# EAGLE design tracksoar programmer (EAGLE 7.1.0)
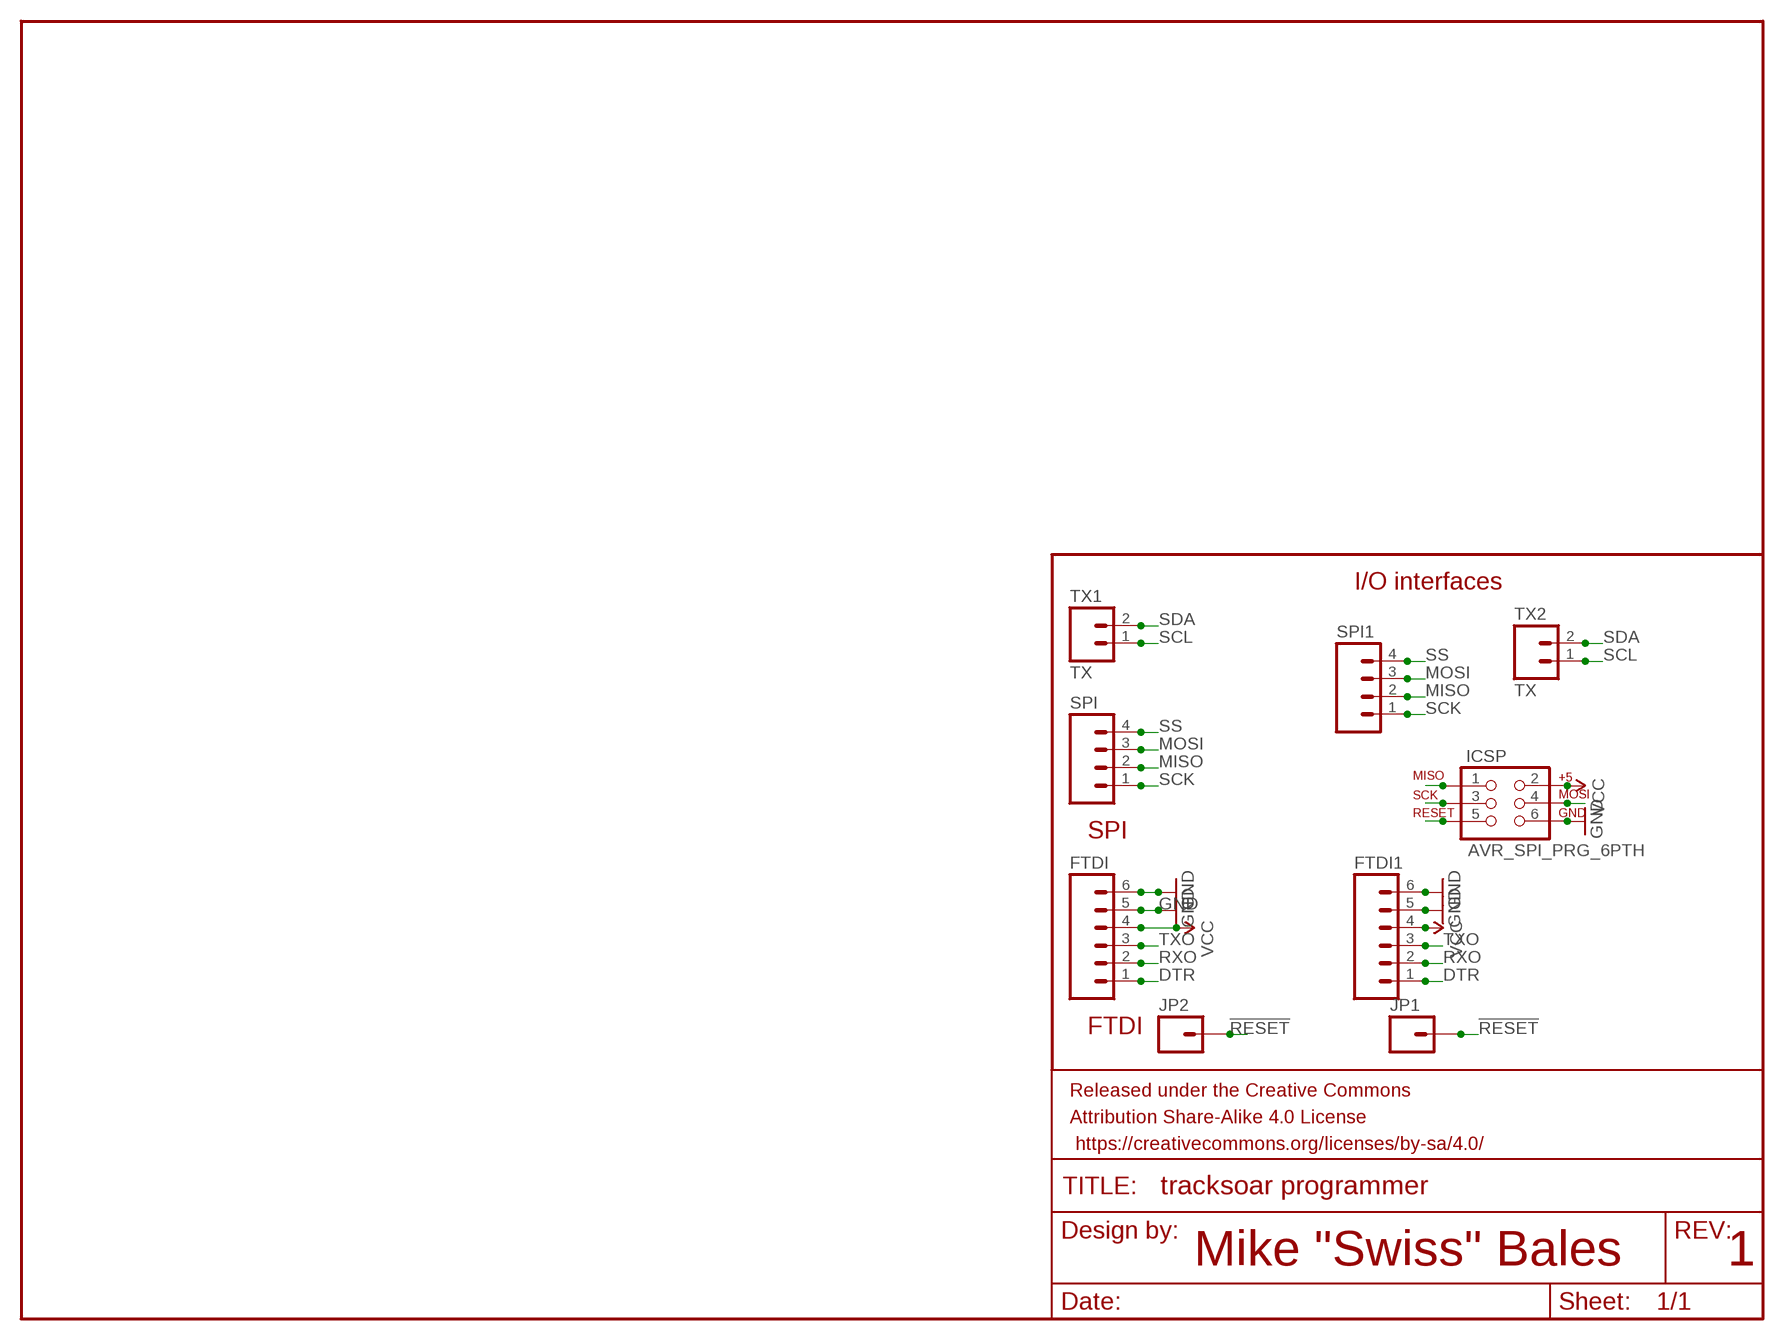
[diagram p0: schematic, sheet 1]

## Parts
FRAME1  FRAME-LETTER  [CREATIVE_COMMONS]
FTDI  M06NO_SILK_FEMALE_PTH  [1X06_NO_SILK]
FTDI1  M06NO_SILK_FEMALE_PTH  [1X06_NO_SILK]
ICSP  AVR_SPI_PRG_6PTH  [2X3]
JP1  M01PTH  [1X01]
JP2  M01PTH  [1X01]
SPI  M04JST-PTH-VERT  [JST-4-PTH-VERT]
SPI1  M04JST-PTH-VERT  [JST-4-PTH-VERT]
TX1  TX  M02JST-PTH-VERT  [JST-2-PTH-VERT]
TX2  TX  M02JST-PTH-VERT  [JST-2-PTH-VERT]

## Nets
!RESET: ICSP.5 JP1.1 JP2.1
DTR: FTDI1.1 FTDI.1
GND: FTDI1.5 FTDI1.6 FTDI.5 FTDI.6 ICSP.6
MISO: ICSP.1 SPI1.2 SPI.2
MOSI: ICSP.4 SPI1.3 SPI.3
RXO: FTDI1.2 FTDI.2
SCK: ICSP.3 SPI1.1 SPI.1
SCL: TX1.1 TX2.1
SDA: TX1.2 TX2.2
SS: SPI1.4 SPI.4
TXO: FTDI1.3 FTDI.3
VCC: FTDI1.4 FTDI.4 ICSP.2

## Notes on the sheet
- I/O interfaces
- SPI
- FTDI
- Mike "Swiss" Bales | 1

## Library data of the parts
FRAME1 = SparkFun-Aesthetics:FRAME-LETTER: Schematic Frame Standard 8.5x11 US Letter frame
FTDI FTDI1 = SparkFun-Connectors:M06: Header 6 Standard 6-pin 0.1" header. Use with straight break away headers (SKU : PRT-00116), right angle break away headers (PRT-00553), swiss pins (PRT-00743), machine pins (PRT-00117), and female headers (PRT-00115). Molex polarized connector foot print use with SKU : PRT-08094 with associated crimp pins and housings. NOTES ON THE VARIANTS LOCK and LOCK_LONGPADS... This footprint was designed to help hold the alignment of a through-hole component (i.e. 6-pin header) while soldering it into place. You may notice that each hole has been shifted either up or down by 0.005 of an inch from it's more standard position (which is a perfectly straight line). This slight alteration caused the pins (the squares in the middle) to touch the edges of the holes. Because they are alternating, it causes a "brace" to hold the component in place. 0.005 has proven to be the perfect amount of "off-center" position when using our standard breakaway headers. Although looks a little odd when you look at the bare footprint, once you have a header in there, the alteration is very hard to notice. Also,if you push a header all the way into place, it is covered up entirely on the bottom side. This idea of altering the position of holes to aid alignment will be further integrated into the Sparkfun Library for other footprints. It can help hold any component with 3 or more connection pins.; PROD_ID: CONN-08437
ICSP = SparkFun-Connectors:AVR_SPI_PRG_6: AVR ISP 6 Pin This is the reduced ISP connector for AVR programming. Common on Arduino. This footprint will take up less PCB space and can be used with a 10-pin to 6-pin adapter such as SKU: BOB-08508 **Special note about "TEST_POINT" package. The stop mask is on the top side, so if you want your programming test points to be on the bottom of your board, make sure to place this package on the bottom side of the board. This also ensure that the orientation to program from the bottom side will be correct.
JP1 JP2 = SparkFun-Connectors:M01: Header 1 Standard 1-pin 0.1" header. Use with straight break away headers (SKU : PRT-00116), right angle break away headers (PRT-00553), swiss pins (PRT-00743), machine pins (PRT-00117), and female headers (PRT-00115).
SPI SPI1 = SparkFun-Connectors:M04: Header 4 Standard 4-pin 0.1" header. Use with straight break away headers (SKU : PRT-00116), right angle break away headers (PRT-00553), swiss pins (PRT-00743), machine pins (PRT-00117), and female headers (PRT-00115). Molex polarized connector foot print use with SKU : PRT-08231 with associated crimp pins and housings. 1MM SMD Version SKU: PRT-10208
TX1 TX2 = SparkFun-Connectors:M02: Standard 2-pin 0.1" header. Use with - straight break away headers ( PRT-00116) - right angle break away headers (PRT-00553) - swiss pins (PRT-00743) - machine pins (PRT-00117) - female headers (PRT-00115) Molex polarized connector foot print use with: PRT-08233 with associated crimp pins and housings. 2.54_SCREWTERM for use with PRT-10571. 3.5mm Screw Terminal footprints for PRT-08084 5mm Screw Terminal footprints for use with PRT-08432

## Board
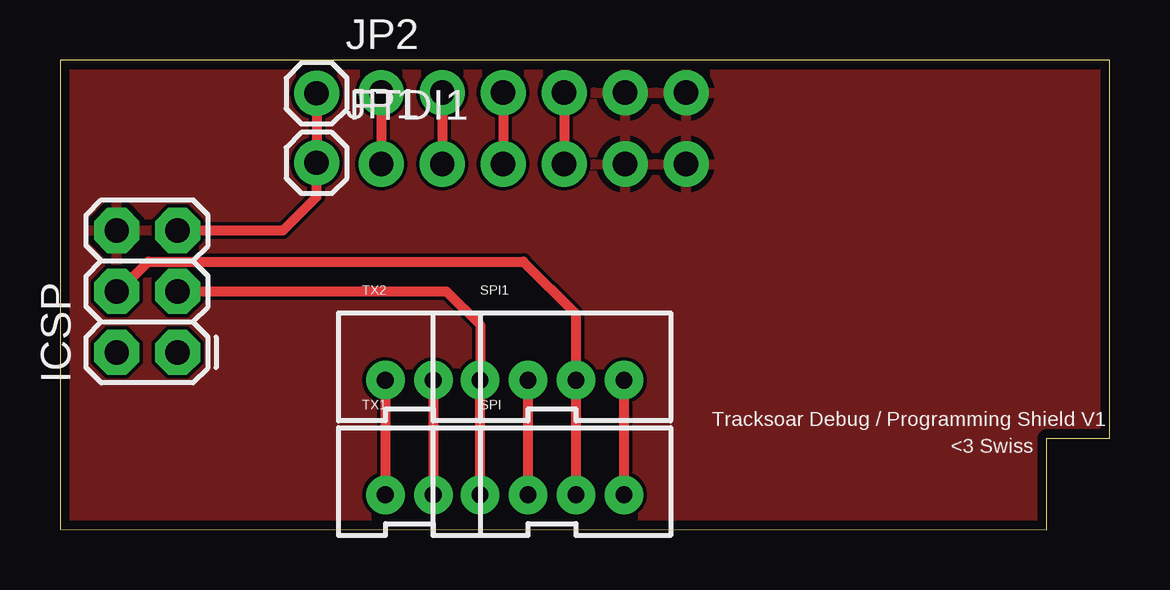
[diagram p1: board, top side]
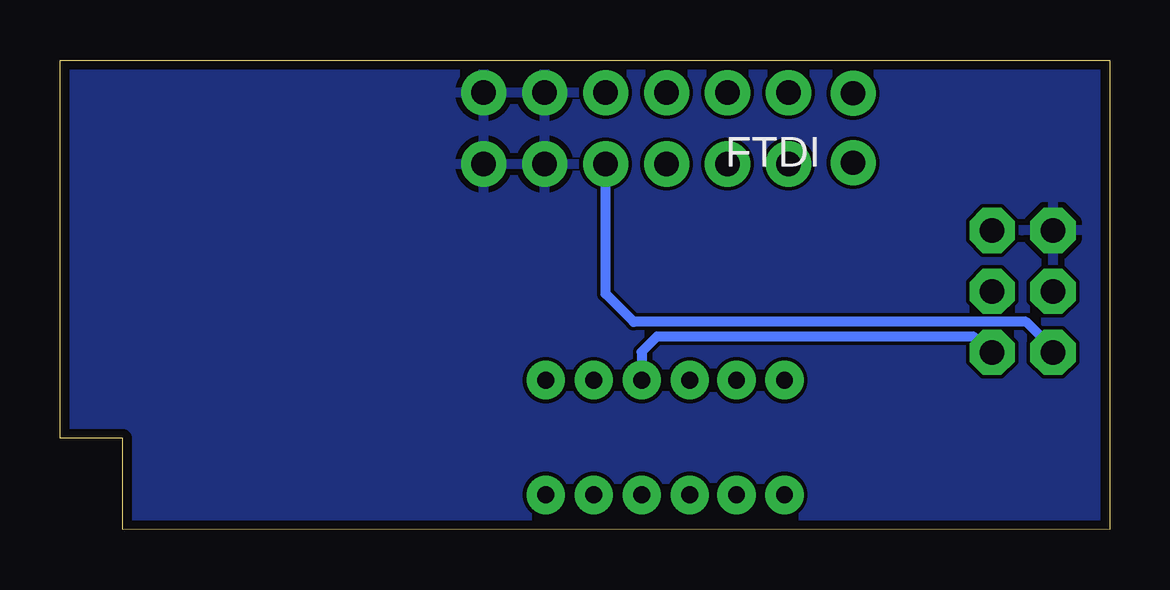
[diagram p2: board, bottom side, seen from below]

Size 43.74 x 19.57 mm. Coordinates in mm from the lower left corner, seen from the top.
Outline: 41.12,0 0,0.03 0,19.57 43.74,19.57 43.74,3.81 41.12,3.81 41.12,0.03
Copper layers (1*16): Top 0.0356mm / dielectric 1.5011mm / Bottom 0.0356mm
Design rules "oshpark-2layer": minimum track width 6mil, minimum drill 13mil, track to track 6mil, track to pad 6mil, pad to pad 6mil, via to via 6mil, smd to smd 6mil, copper to edge 15mil, drill to drill 6mil, minimum pad ring 7mil, minimum via ring 7mil, stop-mask expansion 4mil, vias tented up to drill 0mil, thermal gap 10mil

### Footprints (pad centres in the part's own frame; a part is rotated, then mirrored left to right if it is on the bottom)
1X06_NO_SILK = drill 1.016 pad 1.88: 1 0,0; 2 2.54,0; 3 5.08,0; 4 7.62,0; 5 10.16,0; 6 12.7,0
2X3 = drill 1.016 pad 1.88 octagon: 1 0,0; 2 0,2.54; 3 2.54,0; 4 2.54,2.54; 5 5.08,0; 6 5.08,2.54
1X01 = drill 1.016 pad 1.88: 1 0,0
JST-4-PTH-VERT = drill 0.7 pad 1.6: 1 -3,-0.55; 2 -1,-0.55; 3 1,-0.55; 4 3,-0.55
JST-2-PTH-VERT = drill 0.7 pad 1.6: 1 -1,-0.55; 2 1,-0.55

### Placement (x,y rotation side)
FRAME1  14.78,-7.8 0 top  (outside the outline)
FTDI  13.39,18.21 180 bottom
FTDI1  13.39,15.24 0 top
ICSP  4.9,7.39 90 top
JP1  10.69,15.29 0 top
JP2  10.69,18.19 0 top
SPI  20.5,2.01 0 top
SPI1  20.5,6.78 0 top
TX1  14.55,2.01 0 top
TX2  14.55,6.78 0 top

### Tracks (layer width: path | path; a pad name or v marks a point on that pad's centre or on a via)
!RESET
  Top 0.406: JP2.1 JP1.1 10.69,13.87 9.3,12.47 ICSP.5
DTR
  Top 0.406: FTDI.1 FTDI1.1
GND
  pour Top: 0,19.58 43.74,19.58 43.74,0 0,0.03 0.05,3.78
  pour Bottom: 0,19.58 43.74,19.58 43.74,0 0,0.03 0.05,3.78
MISO
  Top 0.406: SPI1.2 SPI.2
  Bottom 0.406: ICSP.1 5.69,8.05 18.87,8.05 19.51,7.42 SPI1.2
MOSI
  Top 0.406: SPI.3 SPI1.3 21.49,8.99 19.3,11.18 3.68,11.18 2.44,9.93 ICSP.4
RXO
  Top 0.406: FTDI.2 FTDI1.2
SCK
  Top 0.406: ICSP.3 16.1,9.93 17.5,8.53 SPI1.1 SPI.1
SCL
  Top 0.406: TX2.1 TX1.1
SDA
  Top 0.406: TX2.2 TX1.2
SS
  Top 0.406: SPI1.4 SPI.4
TXO
  Top 0.406: FTDI.3 FTDI1.3
VCC
  Top 0.406: FTDI.4 FTDI1.4
  Bottom 0.406: ICSP.2 2.36,7.54 3.48,8.66 19.84,8.66 21.01,9.83 FTDI1.4

### Text on the board
tNames: Tracksoar Debug / Programming Shield V1 | <3 Swiss